# EAGLE design Flash (EAGLE 7.6.0)
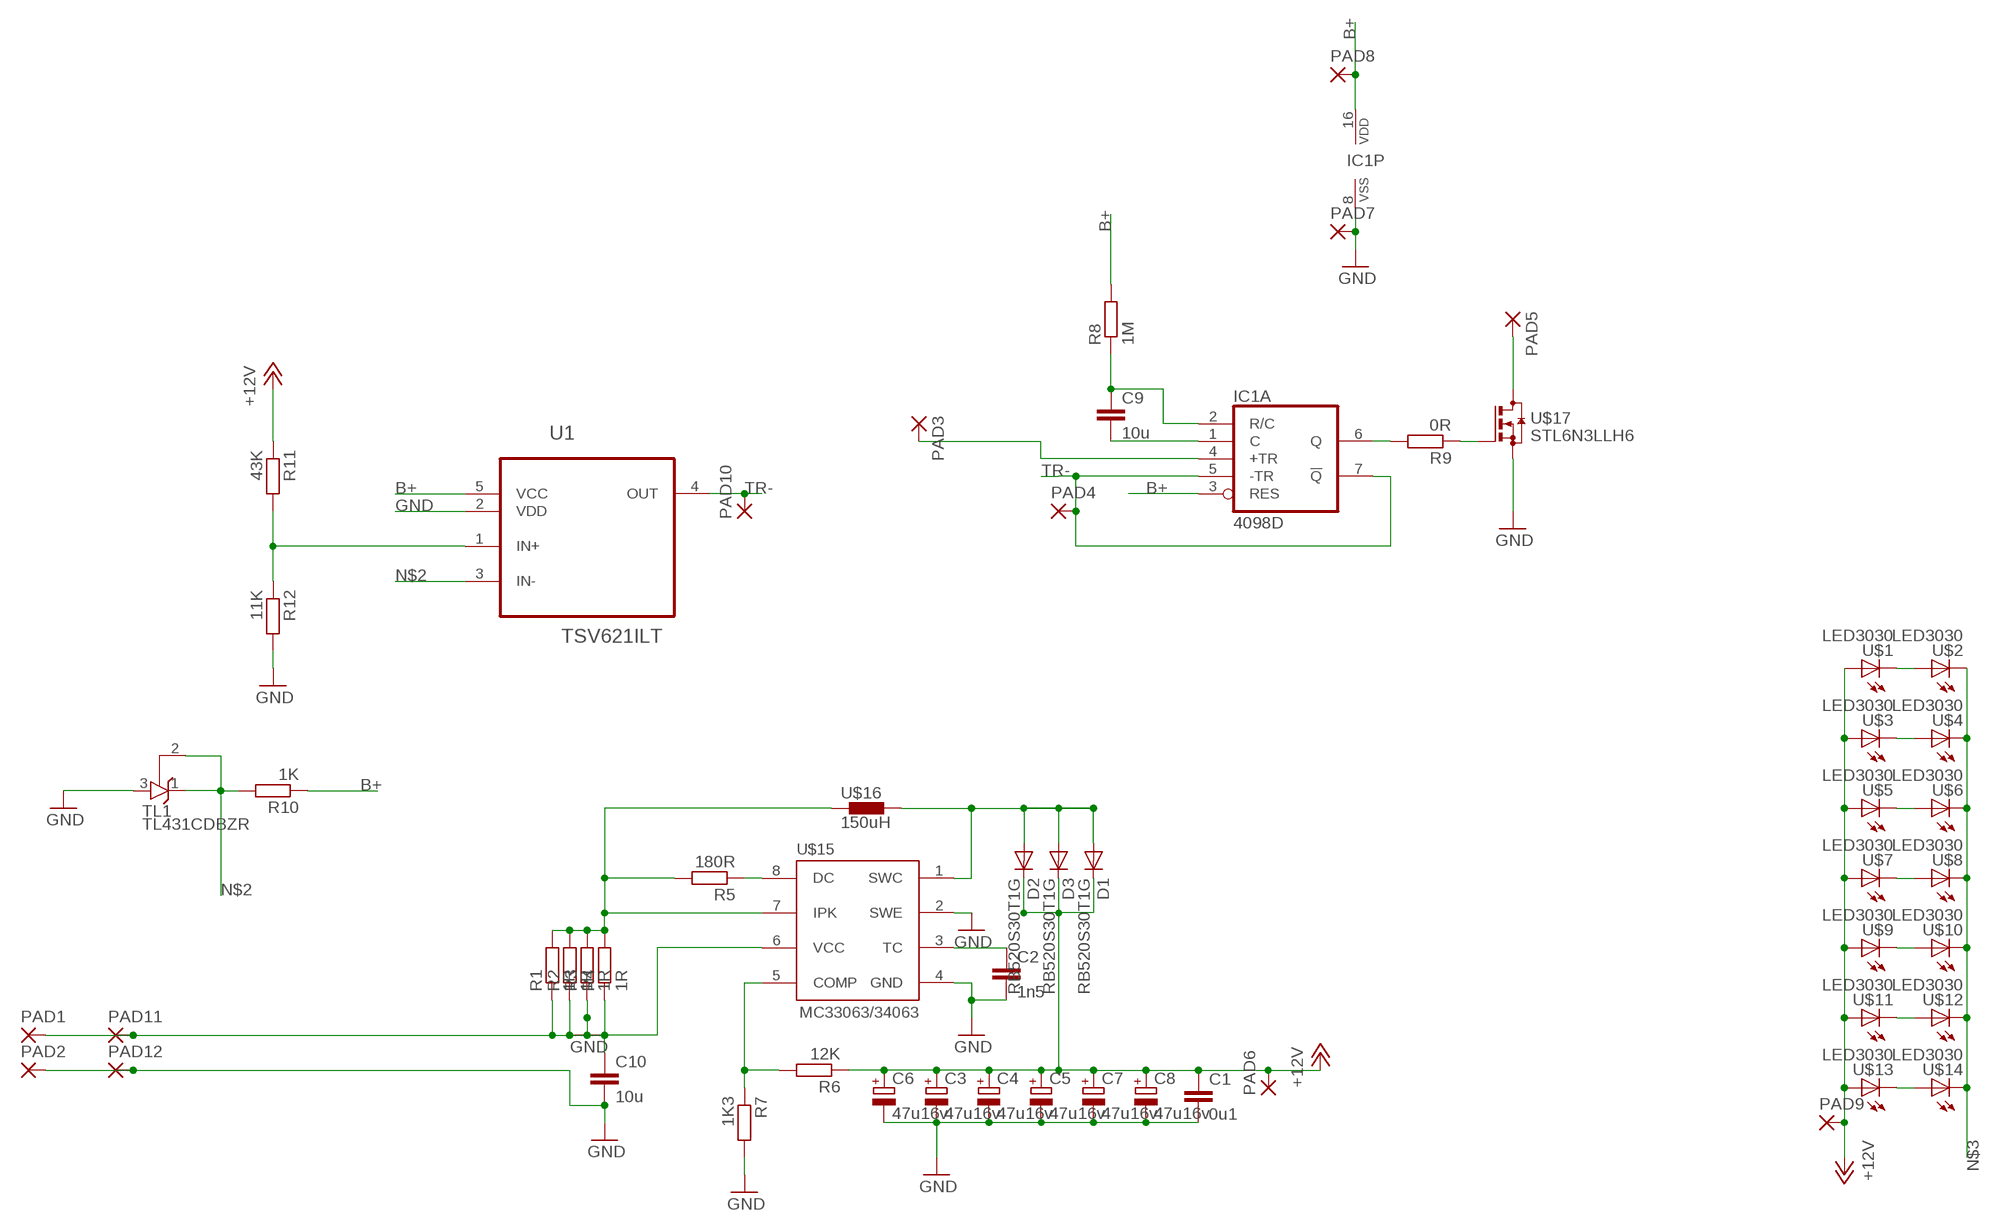
[diagram p0: schematic, sheet 1]

## Parts
C1  0u1  C-EUC0805  [C0805]
C2  1n5  C-EUC0805  [C0805]
C3  47u16v  CPOL-EU153CLV-0605  [153CLV-0605]
C4  47u16v  CPOL-EU153CLV-0605  [153CLV-0605]
C5  47u16v  CPOL-EU153CLV-0605  [153CLV-0605]
C6  47u16v  CPOL-EU153CLV-0605  [153CLV-0605]
C7  47u16v  CPOL-EU153CLV-0605  [153CLV-0605]
C8  47u16v  CPOL-EU153CLV-0605  [153CLV-0605]
C9  10u  C-EUC0805  [C0805]
C10  10u  C-EUC1206  [C1206]
D1  RB520S30T1G  DIODE-SOD523  [SOD523]
D2  RB520S30T1G  DIODE-SOD523  [SOD523]
D3  RB520S30T1G  DIODE-SOD523  [SOD523]
IC1  4098D  [SO16]
PAD1  SMD2  [SMD1,27-2,54]
PAD2  SMD2  [SMD1,27-2,54]
PAD3  SMD2  [SMD1,27-2,54]
PAD4  SMD2  [SMD1,27-2,54]
PAD5  SMD2  [SMD1,27-2,54]
PAD6  SMD2  [SMD1,27-2,54]
PAD7  SMD2  [SMD1,27-2,54]
PAD8  SMD2  [SMD1,27-2,54]
PAD9  SMD2  [SMD1,27-2,54]
PAD10  SMD2  [SMD1,27-2,54]
PAD11  SMD2  [SMD1,27-2,54]
PAD12  SMD2  [SMD1,27-2,54]
R1  1R  R-EU_R0805  [R0805]
R2  1R  R-EU_R0805  [R0805]
R3  1R  R-EU_R0805  [R0805]
R4  1R  R-EU_R0805  [R0805]
R5  180R  R-EU_R0805  [R0805]
R6  12K  R-EU_R0805  [R0805]
R7  1K3  R-EU_R0805  [R0805]
R8  1M  R-EU_R0805  [R0805]
R9  0R  R-EU_R0805  [R0805]
R10  1K  R-EU_R0805  [R0805]
R11  43K  R-EU_R0805  [R0805]
R12  11K  R-EU_R0805  [R0805]
TL1  TL431CDBZR  [SOT23]
U1  TSV621ILT  [SOT95P280X145-5N]
U$1  LED3030  [LED3030]
U$2  LED3030  [LED3030]
U$3  LED3030  [LED3030]
U$4  LED3030  [LED3030]
U$5  LED3030  [LED3030]
U$6  LED3030  [LED3030]
U$7  LED3030  [LED3030]
U$8  LED3030  [LED3030]
U$9  LED3030  [LED3030]
U$10  LED3030  [LED3030]
U$11  LED3030  [LED3030]
U$12  LED3030  [LED3030]
U$13  LED3030  [LED3030]
U$14  LED3030  [LED3030]
U$15  MC33063/MC34063D  [SO08]
U$16  150uH  INDUCTOR6045  [L6045]
U$17  STL6N3LLH6  [POWERFLAT-2X2]

## Nets
+12V: C1.1 C3.+ C4.+ C5.+ C6.+ C7.+ C8.+ D1.C D2.C D3.C PAD6.1(P) PAD9.1(P) R6.1 R11.1 U$1.P$1(A) U$3.P$1(A) U$5.P$1(A) U$7.P$1(A) U$9.P$1(A) U$11.P$1(A) U$13.P$1(A)
B+: C10.1 IC1.3(A:RES) IC1.16(P:VDD) PAD1.1(P) PAD8.1(P) PAD11.1(P) R1.1 R2.1 R3.1 R4.1 R8.2 R10.1 U1.5(VCC) U$15.6(VCC) ; supply symbol labelled GND
GND: C1.2 C2.2 C3.- C4.- C5.- C6.- C7.- C8.- C10.2 IC1.8(P:VSS) PAD2.1(P) PAD7.1(P) PAD12.1(P) R7.2 R12.2 TL1.3(A) U1.2(VDD) U$15.2(SWE) U$15.4(GND) U$17.S U$17.S4(S)
N$1: U$1.P$2(C) U$2.P$1(A)
N$2: R10.2 TL1.1(C) TL1.2(R) U1.3(IN-)
N$3: PAD5.1(P) U$2.P$2(C) U$4.P$2(C) U$6.P$2(C) U$8.P$2(C) U$10.P$2(C) U$12.P$2(C) U$14.P$2(C) U$17.D U$17.D1(D) U$17.D2(D) U$17.D5(D) U$17.D6(D)
N$4: U$3.P$2(C) U$4.P$1(A)
N$5: R11.2 R12.1 U1.1(IN+)
N$6: IC1.4(A:+TR) PAD3.1(P)
N$7: U$5.P$2(C) U$6.P$1(A)
N$8: R1.2 R2.2 R3.2 R4.2 R5.2 U$15.7(IPK) U$16.P$1
N$9: R5.1 U$15.8(DC)
N$10: U$7.P$2(C) U$8.P$1(A)
N$11: R6.2 R7.1 U$15.5(COMP)
N$12: D1.A D2.A D3.A U$15.1(SWC) U$16.P$2
N$13: U$9.P$2(C) U$10.P$1(A)
N$14: C2.1 U$15.3(TC)
N$16: U$11.P$2(C) U$12.P$1(A)
N$17: C9.2 IC1.1(A:C)
N$18: C9.1 IC1.2(A:R/C) R8.1
N$19: U$13.P$2(C) U$14.P$1(A)
N$20: IC1.6(A:Q) R9.2
N$21: R9.1 U$17.G3(G)
TR-: IC1.5(A:-TR) IC1.7(A:!Q) PAD4.1(P) PAD10.1(P) U1.4(OUT)
Unconnected: IC1.9(B:!Q) IC1.10(B:Q) IC1.11(B:-TR) IC1.12(B:+TR) IC1.13(B:RES) IC1.14(B:R/C) IC1.15(B:C)

## Library data of the parts
C1 C2 C9 C10 = rcl:C-EU: CAPACITOR, European symbol
C3-C8 = rcl:CPOL-EU: POLARIZED CAPACITOR, European symbol
D1-D3 = diode:DIODE-: DIODE
IC1 = 40xx:4098: Dual monostable MULTIVIBRATOR Source: Texas Instruments (Data sheet acquired frm Harris Semiconductor SCHS065) http://pdf1.alldatasheet.com/datasheet-pdf/view/26897/TI/CD4098.html
PAD1-PAD12 = wirepad:SMD2: SMD PAD
R1-R12 = rcl:R-EU_: RESISTOR, European symbol
TL1 = Namenlos:TL431
U1 = ST Microelctronics_By_element14_Batch_1:TSV621ILT: operational amplifiers; MPN: TSV621ILT; OC_FARNELL: 1737213; OC_NEWARK: 26R7211; PACKAGE: SOT-23-5; SUPPLIER: STMICROELECTRONICS
U$1-U$14 = Namenlos:LED3030
U$15 = Namenlos at:MC33063/MC34063: MC33063 and MC34063 Basic DC/DC converter with internal power-NPN transistor, 100KHz, 1.5A peak switch current. 3-40 input/output.
U$16 = Namenlos:INDUCTOR
U$17 = Namenlos:STL6N3LLH6

## Board
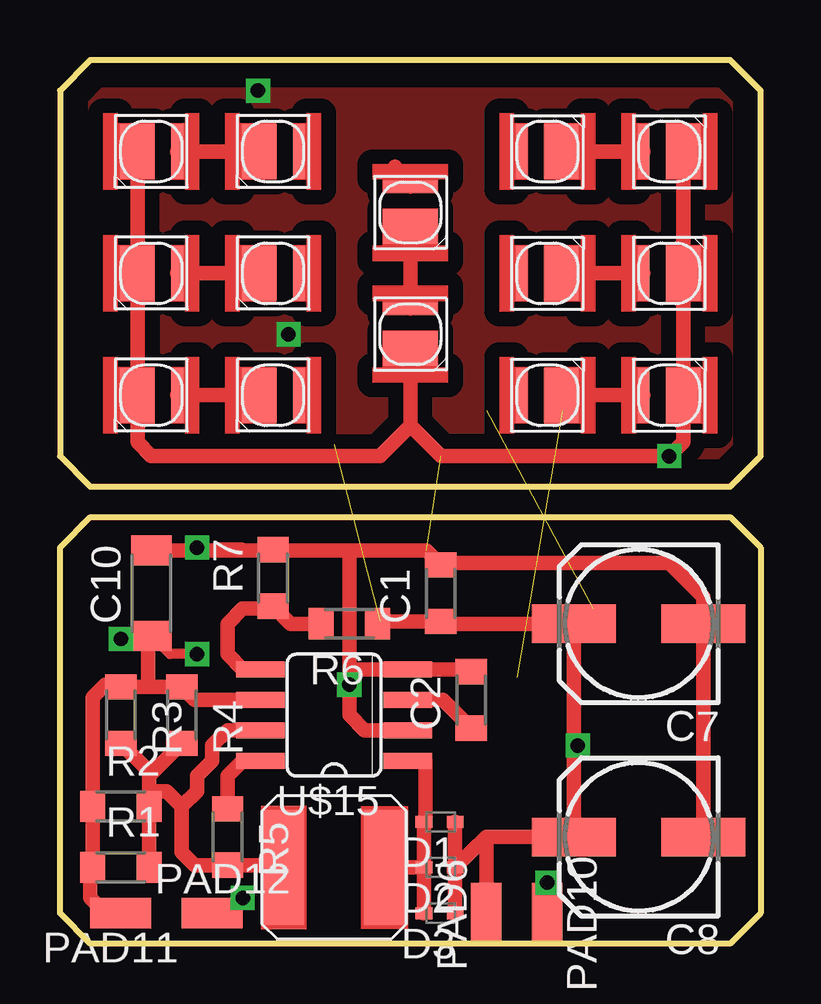
[diagram p1: board, top side]
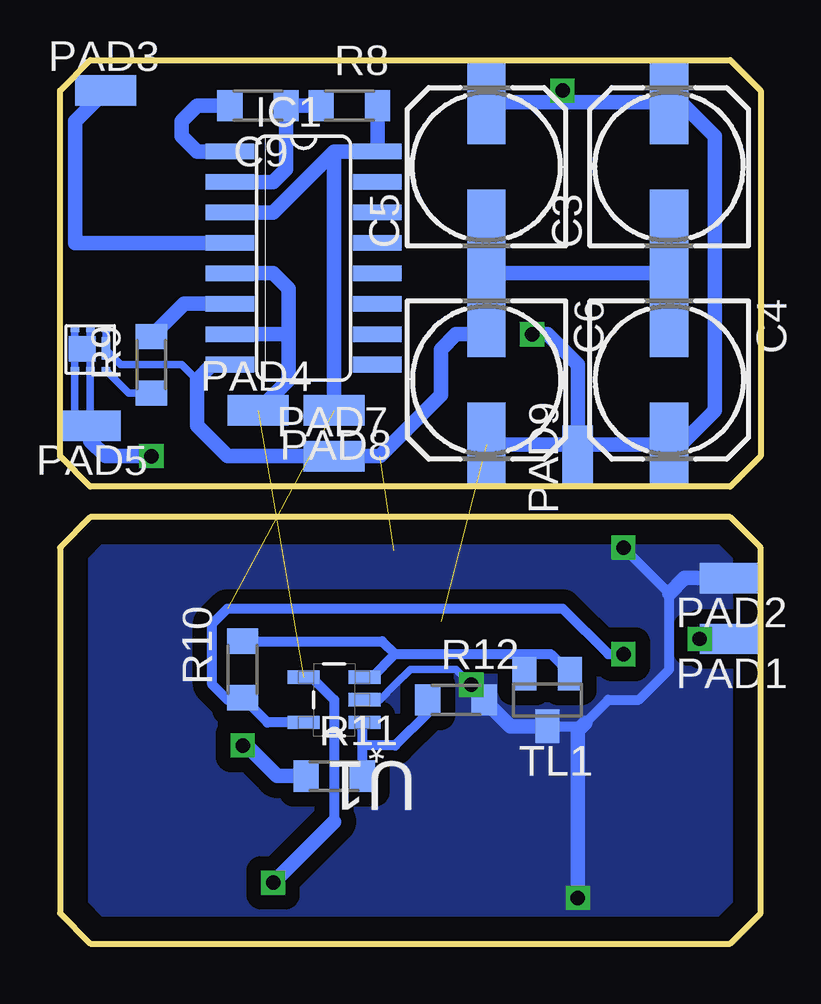
[diagram p2: board, bottom side, seen from below]

Size 29.21 x 36.83 mm. Coordinates in mm from the lower left corner, seen from the top.
Outline: 0,35.56 0,20.32 1.27,19.05 27.94,19.05 29.21,20.32 29.21,35.56 27.94,36.83 1.27,36.83 0,35.56
Outline: 0,1.27 0,16.51 1.27,17.78 27.94,17.78 29.21,16.51 29.21,1.27 27.94,0 1.27,0 0,1.27
Copper layers (1*16): Top 0.035mm / dielectric 1.5mm / Bottom 0.035mm
Design rules "default": minimum track width 10mil, minimum drill 24mil, track to track 8mil, track to pad 8mil, pad to pad 8mil, via to via 8mil, smd to smd 8mil, copper to edge 40mil, drill to drill 8mil, minimum pad ring 10mil, minimum via ring 8mil, stop-mask expansion 4mil, vias tented up to drill 0mil, thermal gap 10mil

### Footprints (pad centres in the part's own frame; a part is rotated, then mirrored left to right if it is on the bottom)
C0805 = smd 1.05 x 1.3: 1 -1.175,0; 2 1.175,0
153CLV-0605 = smd 3.5 x 1.6: + 2.7,0; - -2.7,0
C1206 = smd 1.25 x 1.7: 1 -1.775,0; 2 1.775,0
SOD523 = smd 0.7 x 0.5: A 0.7,0; C -0.6,0
SO16 = smd 0.66 x 2.032: 1 -4.445,-3.073; 2 -3.175,-3.073; 3 -1.905,-3.073; 4 -0.635,-3.073; 5 0.635,-3.073; 6 1.905,-3.073; 7 3.175,-3.073; 8 4.445,-3.073; 9 4.445,3.073; 10 3.175,3.073; 11 1.905,3.073; 12 0.635,3.073; 13 -0.635,3.073; 14 -1.905,3.073; 15 -3.175,3.073; 16 -4.445,3.073
SMD1,27-2,54 = smd 1.27 x 2.54: 1 0,0
R0805 = smd 1.05 x 1.3: 1 -1.175,0; 2 1.175,0
SOT23 = smd 1 x 1.4: 1 -0.95,-1.1; 2 0.95,-1.1; 3 0,1.1
SOT95P280X145-5N = smd 1.321 x 0.559: 1 -1.27,0.94; 2 -1.27,0; 3 -1.27,-0.94; 4 1.27,-0.94; 5 1.27,0.94
LED3030 = smd 0.48 x 2.27: P$1 -1.075,0 | smd 1.43 x 2.27: P$2 0.58,0
SO08 = smd 0.66 x 2.032: 1 -1.905,-3.073; 2 -0.635,-3.073; 3 0.635,-3.073; 4 1.905,-3.073; 5 1.905,3.073; 6 0.635,3.073; 7 -0.635,3.073; 8 -1.905,3.073
L6045 = smd 1.7 x 4.8: P$1 -2.1,0; P$2 2.1,0
POWERFLAT-2X2 = smd 1.125 x 1.05: D -0.34,0.028 | smd 0.35 x 0.3: D1 -0.65,-0.875; D2 0,-0.875; D5 0,0.875; D6 -0.65,0.875; G3 0.65,-0.875; S4 0.65,0.875 | smd 0.35 x 0.95: S 0.65,0.05

### Placement (x,y rotation side)
C1  15.88,14.61 90 top
C2  17.15,10.16 90 top
C3  3.81,32.39 90 bottom
C4  3.81,23.5 270 bottom
C5  11.43,32.39 90 bottom
C6  11.43,23.5 270 bottom
C7  24.13,13.34 180 top
C8  24.13,4.45 180 top
C9  20.95,34.93 180 bottom
C10  3.81,14.61 90 top
D1  15.88,5.08 180 top
D2  15.88,3.18 180 top
D3  15.88,1.27 180 top
IC1  19.05,28.58 270 bottom
PAD1  1.27,12.7 90 bottom
PAD2  1.27,15.24 90 bottom
PAD3  27.3,35.56 270 bottom
PAD4  20.95,22.23 270 bottom
PAD5  27.94,21.59 90 bottom
PAD6  17.78,1.27 0 top
PAD7  17.78,20.32 270 bottom
PAD8  17.78,22.23 90 bottom
PAD9  7.62,20.32 0 bottom
PAD10  20.32,1.27 180 top
PAD11  2.54,1.27 90 top
PAD12  6.35,1.27 270 top
R1  2.54,3.18 0 top
R2  2.54,5.72 0 top
R3  2.54,9.53 270 top
R4  5.08,9.53 270 top
R5  6.99,4.45 270 top
R6  12.07,13.34 180 top
R7  8.89,15.24 90 top
R8  17.15,34.93 0 bottom
R9  25.4,24.13 90 bottom
R10  21.59,11.43 90 bottom
R11  17.78,6.99 0 bottom
R12  12.7,10.16 0 bottom
TL1  8.89,10.16 180 bottom
U1  17.78,10.16 180 bottom
U$1  8.89,33.02 180 top
U$2  3.81,33.02 180 top
U$3  8.89,27.94 180 top
U$4  3.81,27.94 180 top
U$5  8.89,22.86 180 top
U$6  3.81,22.86 180 top
U$7  14.61,30.48 270 top
U$8  14.61,25.4 270 top
U$9  20.32,22.86 0 top
U$10  25.4,22.86 0 top
U$11  20.32,27.94 0 top
U$12  25.4,27.94 0 top
U$13  20.32,33.02 0 top
U$14  25.4,33.02 0 top
U$15  11.43,9.53 90 top
U$16  11.43,3.18 0 top
U$17  27.94,24.77 0 bottom

### Tracks (layer width: path | path; a pad name or v marks a point on that pad's centre or on a via)
+12V  (via drill 0.6)  (1 unrouted)
  Top 0.61: D3.C D2.C | D2.C D1.C | 17.78,4.45 19.05,4.45 C8.+ 21.43,8.26 | 17.78,4.45 D2.C | 21.43,8.26 C7.+ 15.97,13.34 C1.1 13.34,13.43 R6.1 | v21.59,8.26 21.43,8.26 | 13.97,32.39 13.97,32.19 U$7.P$1 | PAD6.1 17.78,4.45
  Bottom 0.61: C6.+ 7.62,20.8 C4.+ 3.34,20.8 1.91,22.23 1.91,27.94 1.91,33.66 3.18,34.93 3.65,34.93 C3.+ C5.+ 8.73,35.09 v8.26,35.56 | R11.1 20.16,6.99 21.43,8.26 | 21.43,8.26 v21.59,8.26 21.43,8.26 | PAD9.1 7.62,24.13 8.89,25.4 v9.53,25.4
  pour Top (isolate 0.61, no thermals): 1.27,19.05 0,20.32 0,35.56 1.27,36.83 27.94,36.83 29.21,35.56 29.21,20.32 27.94,19.05
B+  (via drill 0.6)  (1 unrouted)
  Top 0.406: v5.72,12.07 4.58,12.07 C10.1
  Top 0.61: 3.68,12.7 C10.1 3.68,12.7 | 3.81,10.7 R3.1 2.45,10.8 1.91,10.8 1.37,10.26 R2.1 R1.1 1.27,3.08 1.27,1.91 1.91,1.27 PAD11.1 | 3.81,10.7 R4.1 5.62,10.16 U$15.6 | 3.68,12.7 3.68,10.83 3.81,10.7 | v2.54,12.7 3.68,12.7
  Bottom 0.406: U1.5 20.55,9.22 R10.1 | 21.59,10.16 22.23,10.16 22.86,10.8 22.86,13.34 22.23,13.97 8.26,13.97 6.35,12.07 v5.72,12.07
  Bottom 0.61: IC1.3 20.32,30.48 17.78,33.02 | 17.78,33.02 IC1.16 R8.2 | PAD8.1 17.78,22.86 17.78,23.5 17.78,33.02 | PAD1.1 v2.54,12.7 | 21.59,10.16 R10.1
GND  (via drill 0.6)  (1 unrouted)
  Top 0.305: v12.07,10.8 12.07,10.16 v12.07,10.8
  Top 0.406: 7.49,16.38 7.62,16.51 6.48,16.51 6.35,16.38
  Top 0.61: C2.2 17.05,11.43 U$15.4 12.07,11.43 | U$15.2 12.7,8.89 12.07,9.53 12.07,10.16 v12.07,10.8 12.07,11.43 | C8.- C7.- 26.83,14.45 25.4,15.88 15.97,15.88 C1.2 15.28,16.38 12.07,16.38 | C10.2 6.35,16.38 8.86,16.38 | 8.86,16.38 R7.2 | 8.86,16.38 12.07,16.38 | 12.07,11.43 12.07,12.07 12.07,16.38 | PAD12.1 6.99,1.27 v7.62,1.91
  Bottom 0.305: U$17.S4 U$17.S 27.29,24.75 26.67,24.13 24.13,24.13 23.5,23.5 | U1.2 15.88,10.16 15.24,10.8 14.61,11.43 13.97,11.43 12.7,11.43 v12.07,10.8 11.53,10.26 R12.2
  Bottom 0.406: TL1.3 7.45,9.06 7.3,9.21 6.35,10.16 5.08,10.16 3.81,11.43 3.81,14.61 v5.72,16.51
  Bottom 0.61: C3.- 3.81,27.94 | 3.81,27.94 C4.- 3.81,27.94 | C5.- 11.43,27.94 | 11.43,27.94 C6.- 11.43,25.4 12.7,25.4 13.34,24.77 13.34,22.86 15.88,20.32 19.05,20.32 | 3.81,27.94 11.43,27.94 | IC1.8 22.86,24.13 23.5,23.5 23.5,21.59 22.23,20.32 19.05,20.32 | PAD7.1 19.05,20.32 | TL1.3 10.43,9.06 R12.2 | PAD2.1 2.54,15.24 3.18,15.24 3.81,14.61 | v7.62,1.91 7.62,8.89 7.3,9.21
  pour Bottom (isolate 0.61, no thermals): 27.94,0 29.21,1.27 29.21,16.51 27.94,17.78 1.27,17.78 0,16.51 0,1.27 1.27,0
N$1
  Top 0.61: U$2.P$1 U$1.P$2
N$2
  Bottom 0.406: U1.3 16.21,11.1 15.24,12.07 | 15.24,12.07 9.53,12.07 | 9.53,12.07 8.75,12.07 TL1.1 | TL1.2 9.84,11.75 9.53,12.07 | R10.2 15.78,12.61 15.24,12.07
N$3  (via drill 0.6)
  Top 0.61: U$2.P$2 U$4.P$2 U$6.P$2 3.23,20.9 3.81,20.32 13.34,20.32 14.61,21.59 | 14.61,21.59 U$8.P$2 | U$14.P$2 U$12.P$2 U$10.P$2 25.98,20.9 v25.4,20.32 15.88,20.32 14.61,21.59
  Bottom 0.305: U$17.D5 U$17.D2 PAD5.1 28.57,21.59 28.59,21.61 U$17.D1 28.59,24.77 | U$17.D6 28.59,24.77 | U$17.D 28.56,24.79 28.59,24.77
  Bottom 0.61: PAD5.1 27.94,20.96 27.3,20.32 v25.4,20.32
N$4
  Top 0.61: U$3.P$2 U$4.P$1
N$5
  Bottom 0.406: R11.2 16.61,8.26 | 16.61,8.26 16.61,9.13 U1.1 | R12.1 13.88,9.62 15.24,8.26 16.61,8.26
N$6
  Bottom 0.61: PAD3.1 28.57,34.29 28.57,29.21 IC1.4
N$7
  Top 0.61: U$6.P$1 U$5.P$2
N$8
  Top 0.61: R1.2 R2.2 3.72,6.35 | 3.72,6.35 3.72,6.99 | 3.72,6.99 3.72,7.18 R3.2 | R4.2 3.72,6.99 | 5.08,5.72 5.08,3.81 5.62,3.27 R5.2 9.24,3.27 U$16.P$1 | 5.08,5.72 4.45,6.35 3.72,6.35 | U$15.7 6.99,8.89 6.35,8.26 6.35,7.62 5.72,6.99 5.72,6.35 5.08,5.72
N$9
  Top 0.61: R5.1 6.99,6.99 7.62,7.62 U$15.8
N$10
  Top 0.61: U$8.P$1 U$7.P$2
N$11
  Top 0.61: R6.2 9.62,13.34 R7.1 8.79,13.97 7.62,13.97 6.99,13.34 6.99,12.07 7.62,11.43 U$15.5
N$12
  Top 0.61: D3.A D2.A | D2.A D1.A 15.24,5.15 15.24,7.62 U$15.1 | U$16.P$2 D2.A
N$13
  Top 0.61: U$10.P$1 U$9.P$2
N$14
  Top 0.61: U$15.3 15.97,10.16 C2.1
N$16
  Top 0.61: U$11.P$2 U$12.P$1
N$17
  Bottom 0.61: C9.2 23.5,34.93 24.13,34.29 24.13,33.66 23.5,33.02 IC1.1
N$18
  Bottom 0.61: R8.1 C9.1 19.78,32.29 20.32,31.75 IC1.2
N$19
  Top 0.61: U$14.P$1 U$13.P$2
N$20
  Bottom 0.61: IC1.6 24.04,26.67 R9.2
N$21
  Bottom 0.305: R9.1 26.36,22.96 U$17.G3
TR-  (via drill 0.6)  (1 unrouted)
  Top 0.61: v20.32,2.54 PAD10.1
  Bottom 0.406: U1.4 18.72,11.1 17.78,10.16 17.78,5.08
  Bottom 0.61: IC1.7 19.69,25.4 | 19.69,25.4 19.69,23.5 PAD4.1 | IC1.5 20.32,27.94 19.69,27.31 19.69,26.67 19.69,25.4 | 17.78,5.08 v20.32,2.54